# Altium project Placa massa.PrjPcb
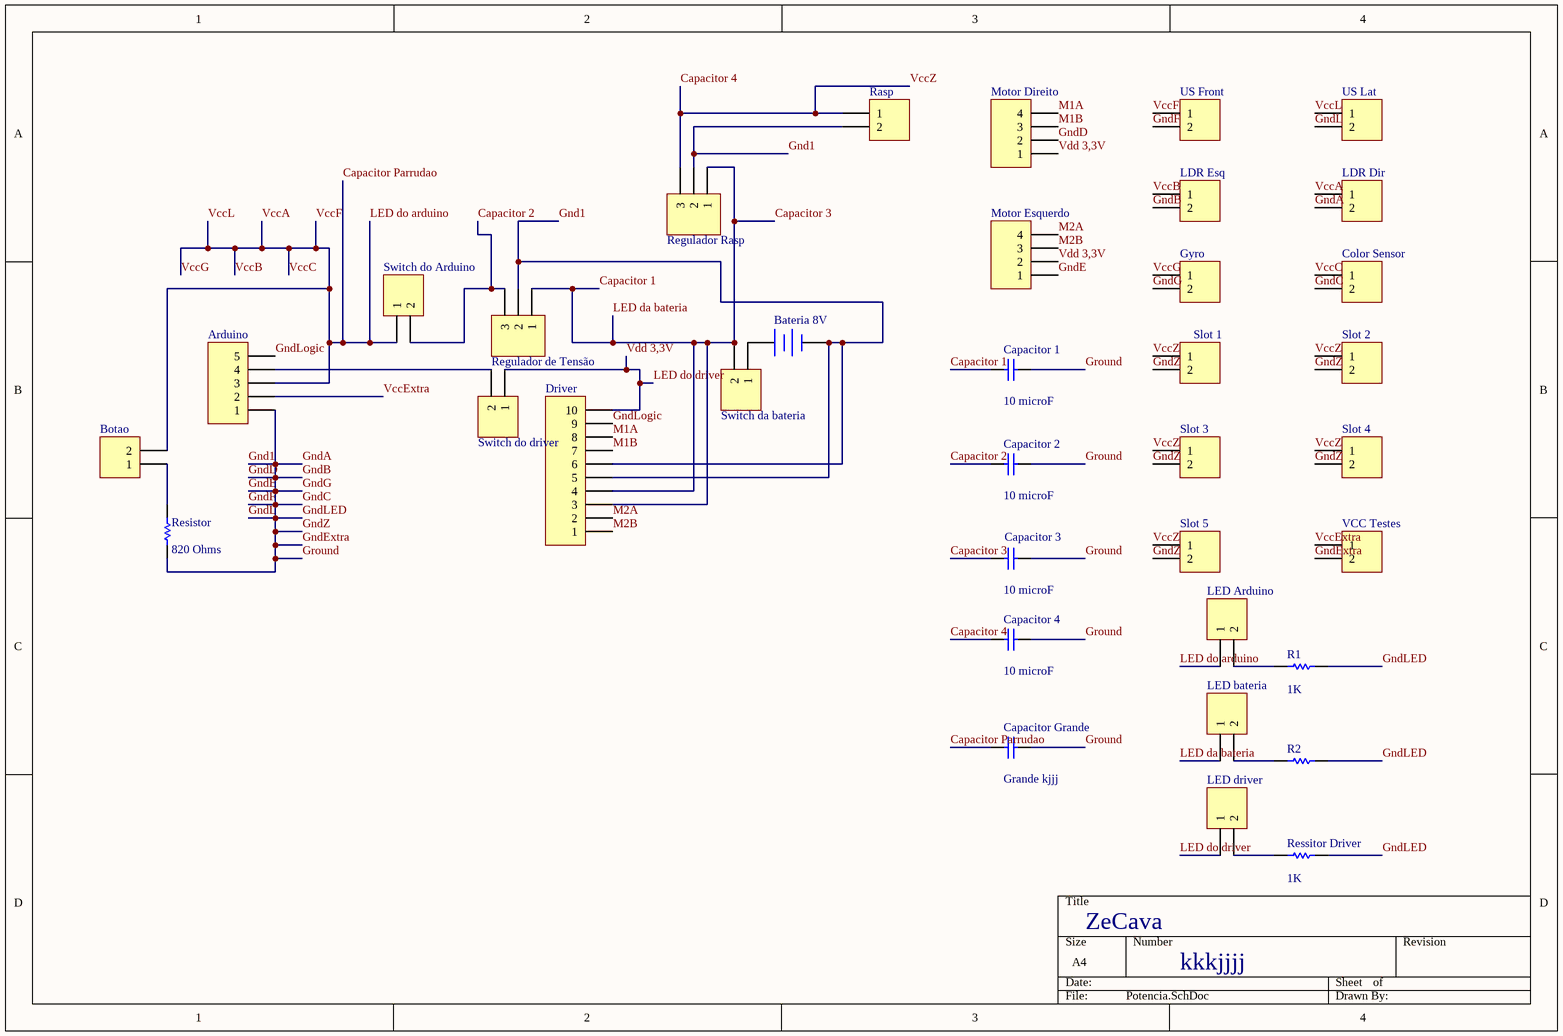
[diagram p0: Potencia.SchDoc]
2 sheets, 59 parts. Net scope: global (net labels, ports and power ports of the same name join across sheets).
Board file: Potencia.PcbDoc
Sheets:
  Potencia.SchDoc
  Logica.SchDoc

## Sheet Potencia.SchDoc
size A4

### Parts
(Parts that share a designator on the sheet are numbered #1, #2 ... from top to bottom, then left to right.)
Arduino#1  Header 5  [HDR1X5]  (value not drawn)
Bateria_8V  Battery  [BAT-2]  (value not drawn)
Botao  Header 2  [HDR1X2]  (value not drawn)
Capacitor_1  value 10 microF  [RAD-0.3]  (hidden comment: Cap)
Capacitor_2  value 10 microF  [RAD-0.3]  (hidden comment: Cap)
Capacitor_3  value 10 microF  [RB7.6-15]  (hidden comment: Cap)
Capacitor_4  value 10 microF  [RAD-0.3]  (hidden comment: Cap)
Capacitor_Grande  value Grande kjjj  [RAD-0.3]  (hidden comment: Cap)
Color_Sensor#1  Header 2  [HDR1X2]  (value not drawn)
Driver#1  Header 10  [HDR1X10]  (value not drawn)
Gyro#1  Header 2  [HDR1X2]  (value not drawn)
LDR_Dir#1  Header 2  [HDR1X2]  (value not drawn)
LDR_Esq#1  Header 2  [HDR1X2]  (value not drawn)
LED_Arduino  Header 2  [HDR1X2]  (value not drawn)
LED_bateria  Header 2  [HDR1X2]  (value not drawn)
LED_driver  Header 2  [HDR1X2]  (value not drawn)
Motor_Direito  Header 4  [HDR1X4]  (value not drawn)
Motor_Esquerdo  Header 4  [HDR1X4]  (value not drawn)
R1  value 1K  [AXIAL-0.3]  (hidden comment: Res1)
R2  Res1  [AXIAL-0.3]  (value not drawn)
Rasp  Header 2  [HDR1X2]  (value not drawn)
Regulador_de_Tensão  Header 3  [HDR1X3]  (value not drawn)
Regulador_Rasp  Header 3  [HDR1X3]  (value not drawn)
Resistor  value 820 Ohms  [AXIAL-0.3]  (hidden comment: Res1)
Ressitor_Driver  value 1K  [AXIAL-0.3]  (hidden comment: Res1)
Slot_1  Header 2  [HDR1X2]  (value not drawn)
Slot_2  Header 2  [HDR1X2]  (value not drawn)
Slot_3  Header 2  [HDR1X2]  (value not drawn)
Slot_4  Header 2  [HDR1X2]  (value not drawn)
Slot_5  Header 2  [HDR1X2]  (value not drawn)
Switch_da_bateria  Header 2  [HDR1X2]  (value not drawn)
Switch_do_Arduino  Header 2  [HDR1X2]  (value not drawn)
Switch_do_driver  Header 2  [HDR1X2]  (value not drawn)
US_Front#1  Header 2  [HDR1X2]  (value not drawn)
US_Lat  Header 2  [HDR1X2]  (value not drawn)
VCC_Testes  Header 2  [HDR1X2]  (value not drawn)

### Nets
Capacitor 1: Capacitor_1.1 Capacitor_3.1 Driver#1.3 Driver#1.4 LED_bateria.1 Regulador_de_Tensão.1 Regulador_Rasp.1 Switch_da_bateria.2  [also labelled Capacitor 3, LED da bateria]
Capacitor 2: Capacitor_2.1 Regulador_de_Tensão.3 Switch_do_Arduino.2
Capacitor 4: Capacitor_4.1 Rasp.1 Regulador_Rasp.3 Slot_1.1 Slot_2.1 Slot_3.1 Slot_4.1 Slot_5.1  [also labelled VccZ]
Capacitor Parrudao: Arduino#1.3 Botao.2 Capacitor_Grande.1 Color_Sensor#1.1 Gyro#1.1 LDR_Dir#1.1 LDR_Esq#1.1 LED_Arduino.1 Switch_do_Arduino.1 US_Front#1.1 US_Lat.1  [also labelled LED do arduino, VccA, VccB, VccC, VccF, VccG, VccL]
Gnd1: Arduino#1.1 Bateria_8V.2(-) Capacitor_1.2 Capacitor_2.2 Capacitor_3.2 Capacitor_4.2 Capacitor_Grande.2 Color_Sensor#1.2 Driver#1.5 Driver#1.6 Gyro#1.2 LDR_Dir#1.2 LDR_Esq#1.2 Motor_Direito.2 Motor_Esquerdo.1 R1.2 R2.2 Rasp.2 Regulador_de_Tensão.2 Regulador_Rasp.2 Resistor.1 Ressitor_Driver.2 Slot_1.2 Slot_2.2 Slot_3.2 Slot_4.2 Slot_5.2 US_Front#1.2 US_Lat.2 VCC_Testes.2  [also labelled GndA, GndB, GndC, GndD, GndE, GndExtra, GndF, GndG, GndL, GndLED, GndZ, Ground]
GndLogic: Arduino#1.5 Driver#1.9
LED do driver: Driver#1.10 LED_driver.1 Motor_Direito.1 Motor_Esquerdo.2 Switch_do_driver.1  [also labelled Vdd 3,3V]
M1A: Driver#1.8 Motor_Direito.4
M1B: Driver#1.7 Motor_Direito.3
M2A: Driver#1.2 Motor_Esquerdo.4
M2B: Driver#1.1 Motor_Esquerdo.3
VccExtra: Arduino#1.2 VCC_Testes.1
NetArduino#1_4: Arduino#1.4 Switch_do_driver.2
NetBateria_8V_1: Bateria_8V.1(+) Switch_da_bateria.1
NetBotao_1: Botao.1 Resistor.2
NetLED_Arduino_2: LED_Arduino.2 R1.1
NetLED_bateria_2: LED_bateria.2 R2.1
NetLED_driver_2: LED_driver.2 Ressitor_Driver.1

### Notes on the sheet
- ZeCava
- kkkjjjj

### Library data of the parts
Arduino#1 = Header 5: Header, 5-Pin; LatestRevisionDate: 17-Jul-2002; LatestRevisionNote: Re-released for DXP Platform.; Publisher: Altium Limited
Bateria_8V = Battery: Multicell Battery; Published: 24-Mar-1999; LatestRevisionDate: 17-Jul-2002; LatestRevisionNote: Re-released for DXP Platform.; PackageReference: BAT-2; Publisher: Altium Limited; PackageDescription: Battery; 2 Leads
Botao Color_Sensor#1 Gyro#1 LDR_Dir#1 LDR_Esq#1 LED_Arduino LED_bateria LED_driver Rasp Slot_1-Slot_5 Switch_da_bateria Switch_do_Arduino Switch_do_driver US_Front#1 US_Lat VCC_Testes = Header 2: Header, 2-Pin; LatestRevisionDate: 17-Jul-2002; LatestRevisionNote: Re-released for DXP Platform.; Publisher: Altium Limited
Capacitor_1-Capacitor_4 Capacitor_Grande = Cap: Capacitor; Published: 8-Jun-2000; LatestRevisionDate: 17-Jul-2002; LatestRevisionNote: Re-released for DXP Platform.; PackageReference: RAD-0.3; Publisher: Altium Limited; PackageDescription: Radial Cap, Thru-Hole; 2 Leads; 0.3 in Pin Spacing
Driver#1 = Header 10: Header, 10-Pin; LatestRevisionDate: 17-Jul-2002; LatestRevisionNote: Re-released for DXP Platform.; Publisher: Altium Limited
Motor_Direito Motor_Esquerdo = Header 4: Header, 4-Pin; LatestRevisionDate: 17-Jul-2002; LatestRevisionNote: Re-released for DXP Platform.; Publisher: Altium Limited
R1 R2 Resistor Ressitor_Driver = Res1: Resistor; Published: 8-Jun-2000; LatestRevisionDate: 17-Jul-2002; LatestRevisionNote: Re-released for DXP Platform.; PackageReference: AXIAL-0.3; Publisher: Altium Limited; PackageDescription: Axial Device, Thru-Hole; 2 Leads; 0.3 in Pin Spacing
Regulador_de_Tensão Regulador_Rasp = Header 3: Header, 3-Pin; LatestRevisionDate: 17-Jul-2002; LatestRevisionNote: Re-released for DXP Platform.; Publisher: Altium Limited

## Sheet Logica.SchDoc
size A4
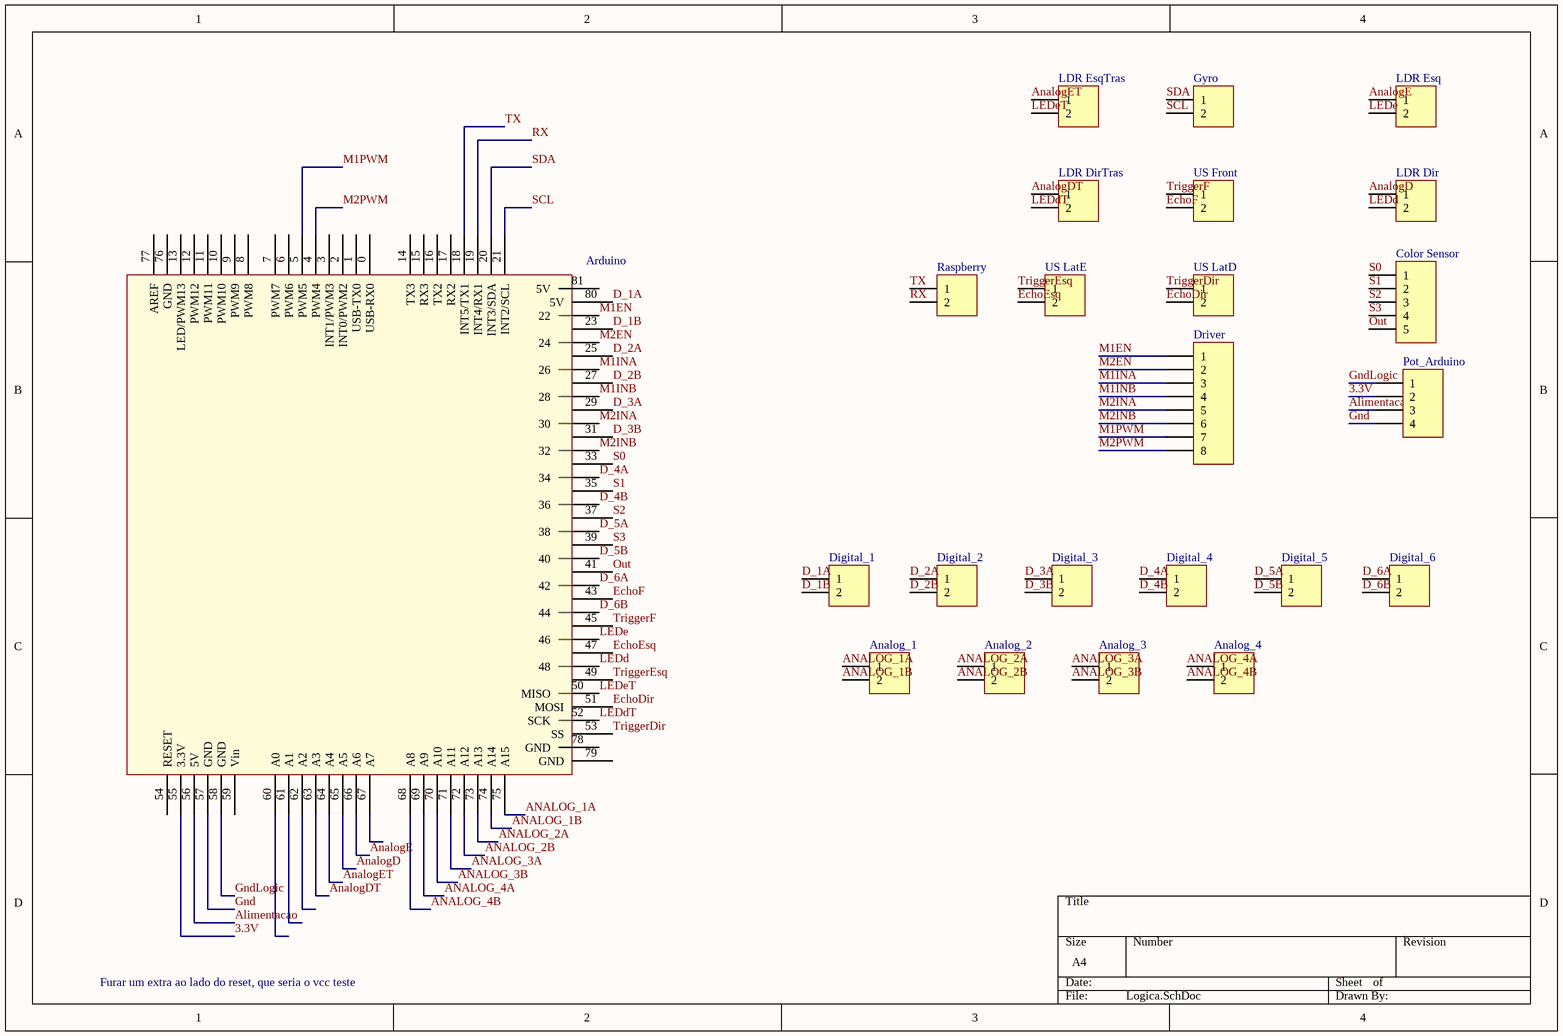
[diagram p1: Logica.SchDoc]

### Parts
(Parts that share a designator on the sheet are numbered #1, #2 ... from top to bottom, then left to right.)
Analog_1  Header 2  [HDR1X2]  (value not drawn)
Analog_2  Header 2  [HDR1X2]  (value not drawn)
Analog_3  Header 2  [HDR1X2]  (value not drawn)
Analog_4  Header 2  [HDR1X2]  (value not drawn)
Arduino#2  Arduino  [Arduino]  (value not drawn)
Color_Sensor#2  Header 5  [HDR1X5]  (value not drawn)
Digital_1  Header 2  [HDR1X2]  (value not drawn)
Digital_2  Header 2  [HDR1X2]  (value not drawn)
Digital_3  Header 2  [HDR1X2]  (value not drawn)
Digital_4  Header 2  [HDR1X2]  (value not drawn)
Digital_5  Header 2  [HDR1X2]  (value not drawn)
Digital_6  Header 2  [HDR1X2]  (value not drawn)
Driver#2  Header 8  [HDR1X8]  (value not drawn)
Gyro#2  Header 2  [HDR1X2]  (value not drawn)
LDR_Dir#2  Header 2  [HDR1X2]  (value not drawn)
LDR_DirTras  Header 2  [HDR1X2]  (value not drawn)
LDR_Esq#2  Header 2  [HDR1X2]  (value not drawn)
LDR_EsqTras  Header 2  [HDR1X2]  (value not drawn)
Pot_Arduino  Header 4  [HDR1X4]  (value not drawn)
Raspberry  Header 2  [HDR1X2]  (value not drawn)
US_Front#2  Header 2  [HDR1X2]  (value not drawn)
US_LatD  Header 2  [HDR1X2]  (value not drawn)
US_LatE  Header 2  [HDR1X2]  (value not drawn)

### Nets
3.3V: Arduino#2.55(3.3V) Pot_Arduino.2
Alimentacao: Arduino#2.56(5V) Pot_Arduino.3
ANALOG_1A: Analog_1.1 Arduino#2.75(A15)
ANALOG_1B: Analog_1.2 Arduino#2.74(A14)
ANALOG_2A: Analog_2.1 Arduino#2.73(A13)
ANALOG_2B: Analog_2.2 Arduino#2.72(A12)
ANALOG_3A: Analog_3.1 Arduino#2.71(A11)
ANALOG_3B: Analog_3.2 Arduino#2.70(A10)
ANALOG_4A: Analog_4.1 Arduino#2.69(A9)
ANALOG_4B: Analog_4.2 Arduino#2.68(A8)
AnalogD: Arduino#2.65(A5) LDR_Dir#2.1
AnalogDT: Arduino#2.63(A3) LDR_DirTras.1
AnalogE: Arduino#2.66(A6) LDR_Esq#2.1
AnalogET: Arduino#2.64(A4) LDR_EsqTras.1
D_1A: Arduino#2.80(5V) Digital_1.1
D_1B: Arduino#2.23 Digital_1.2
D_2A: Arduino#2.25 Digital_2.1
D_2B: Arduino#2.27 Digital_2.2
D_3A: Arduino#2.29 Digital_3.1
D_3B: Arduino#2.31 Digital_3.2
D_4A: Arduino#2.34 Digital_4.1
D_4B: Arduino#2.36 Digital_4.2
D_5A: Arduino#2.38 Digital_5.1
D_5B: Arduino#2.40 Digital_5.2
D_6A: Arduino#2.42 Digital_6.1
D_6B: Arduino#2.44 Digital_6.2
EchoDir: Arduino#2.51(MOSI) US_LatD.2
EchoEsq: Arduino#2.47 US_LatE.2
EchoF: Arduino#2.43 US_Front#2.2
Gnd: Arduino#2.57(GND) Pot_Arduino.4
GndLogic: Arduino#2.58(GND) Pot_Arduino.1
LEDd: Arduino#2.48 LDR_Dir#2.2
LEDdT: Arduino#2.52(SCK) LDR_DirTras.2
LEDe: Arduino#2.46 LDR_Esq#2.2
LEDeT: Arduino#2.50(MISO) LDR_EsqTras.2
M1EN: Arduino#2.22 Driver#2.1
M1INA: Arduino#2.26 Driver#2.3
M1INB: Arduino#2.28 Driver#2.4
M1PWM: Arduino#2.5(PWM5) Driver#2.7
M2EN: Arduino#2.24 Driver#2.2
M2INA: Arduino#2.30 Driver#2.5
M2INB: Arduino#2.32 Driver#2.6
M2PWM: Arduino#2.4(PWM4) Driver#2.8
Out: Arduino#2.41 Color_Sensor#2.5
RX: Arduino#2.19(INT4/RX1) Raspberry.2
S0: Arduino#2.33 Color_Sensor#2.1
S1: Arduino#2.35 Color_Sensor#2.2
S2: Arduino#2.37 Color_Sensor#2.3
S3: Arduino#2.39 Color_Sensor#2.4
SCL: Arduino#2.21(INT2/SCL) Gyro#2.2
SDA: Arduino#2.20(INT3/SDA) Gyro#2.1
TriggerDir: Arduino#2.53(SS) US_LatD.1
TriggerEsq: Arduino#2.49 US_LatE.1
TriggerF: Arduino#2.45 US_Front#2.1
TX: Arduino#2.18(INT5/TX1) Raspberry.1

Not connected (* = marked no-connect by the designer): Arduino#2 0(USB-RX0) 1(USB-TX0) 2(INT0/PWM2) 3(INT1/PWM3) 6(PWM6) 7(PWM7) 8(PWM8) 9(PWM9) 10(PWM10) 11(PWM11) 12(PWM12) 13(LED/PWM13) 14(TX3) 15(RX3) 16(TX2) 17(RX2) 54(RESET) 59(Vin) 60(A0) 61(A1) 62(A2) 67(A7) 76(GND) 77(AREF) 78(GND) 79(GND) 81(5V)

### Notes on the sheet
- Furar um extra ao lado do reset, que seria o vcc teste

### Library data of the parts
Analog_1-Analog_4 Digital_1-Digital_6 Gyro#2 LDR_Dir#2 LDR_DirTras LDR_Esq#2 LDR_EsqTras Raspberry US_Front#2 US_LatD US_LatE = Header 2: Header, 2-Pin; LatestRevisionDate: 17-Jul-2002; LatestRevisionNote: Re-released for DXP Platform.; Publisher: Altium Limited
Color_Sensor#2 = Header 5: Header, 5-Pin; LatestRevisionDate: 17-Jul-2002; LatestRevisionNote: Re-released for DXP Platform.; Publisher: Altium Limited
Driver#2 = Header 8: Header, 8-Pin; LatestRevisionDate: 17-Jul-2002; LatestRevisionNote: Re-released for DXP Platform.; Publisher: Altium Limited
Pot_Arduino = Header 4: Header, 4-Pin; LatestRevisionDate: 17-Jul-2002; LatestRevisionNote: Re-released for DXP Platform.; Publisher: Altium Limited

## Nets that join several sheets
GndLogic: Potencia (Arduino#1.5 Driver#1.9), Logica (Arduino#2.58 Pot_Arduino.1)